# Altium schematic sheet instalation.SchDoc
size A4
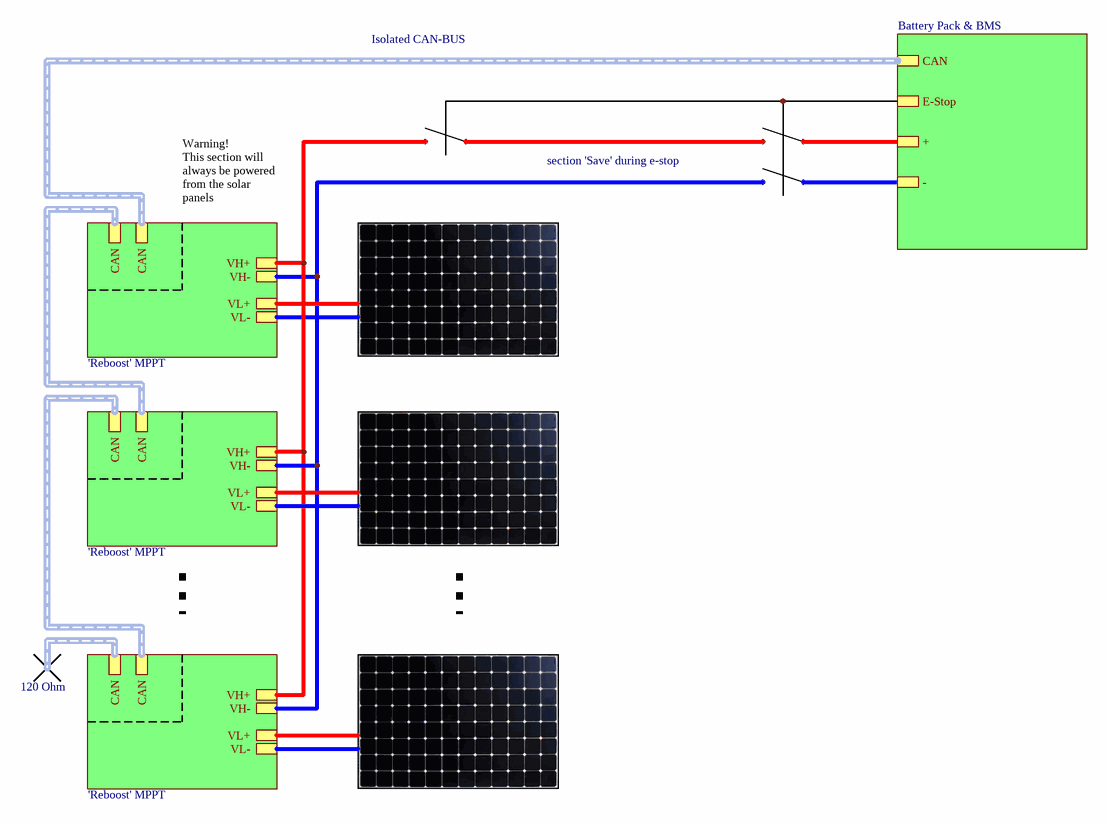
[diagram p0: instalation.SchDoc]

## Sub-sheets
'Reboost' MPPT = File Name: VH+, VH-, VL+, VL-, CAN, CAN
'Reboost' MPPT = File Name: VH+, VH-, VL+, VL-, CAN, CAN
'Reboost' MPPT = File Name: VH+, VH-, VL+, VL-, CAN, CAN
Battery Pack & BMS = File Name: +, -, E-Stop , CAN

## Nets
(unnamed): sheet 'Reboost' MPPT/VH+, sheet 'Reboost' MPPT/VH+, sheet 'Reboost' MPPT/VH+
(unnamed): sheet 'Reboost' MPPT/VH-, sheet 'Reboost' MPPT/VH-, sheet 'Reboost' MPPT/VH-

## Buses and harness runs
harness sheet 'Reboost' MPPT/CAN = sheet Battery Pack & BMS/CAN

## Notes on the sheet
- Isolated CAN-BUS
- section 'Save' during e-stop
- Warning!
  This section will always be powered from the solar panels
- 120 Ohm